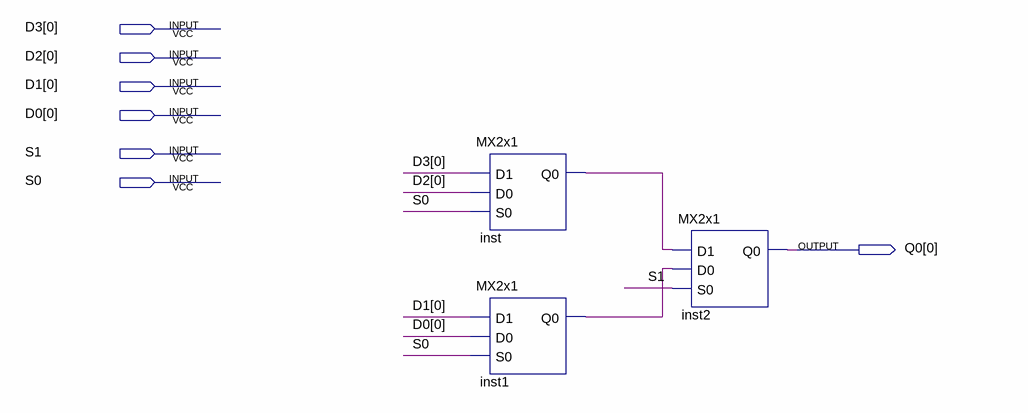
[diagram p0: schematic sheet]
// Quartus schematic MX4x1.bdf as structural Verilog: 3 symbols, 7 pins
module MX4x1 (
  input  [0:0] D3,
  input  [0:0] D2,
  input  [0:0] D1,
  input  [0:0] D0,
  input  S1,
  input  S0,
  output [0:0] Q0
);

  wire inst1_q0, inst_q0;

  MX2x1 inst (.D1(D3[0]), .D0(D2[0]), .S0(S0), .Q0(inst_q0));
  MX2x1 inst1 (.D1(D1[0]), .D0(D0[0]), .S0(S0), .Q0(inst1_q0));
  MX2x1 inst2 (.D1(inst_q0), .D0(inst1_q0), .S0(S1), .Q0(Q0[0]));
endmodule
